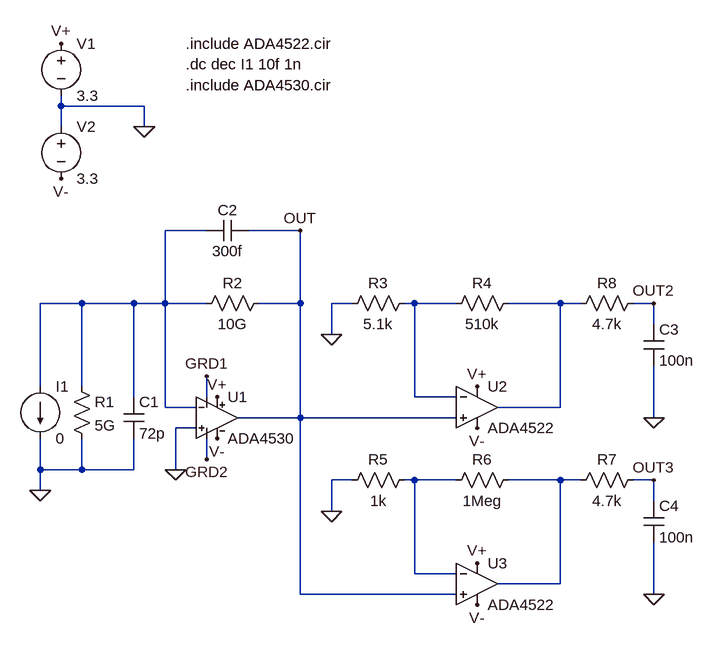
[diagram p0: schematic 008transimpedance_ada4530_ext_amps_trans.asc]
008transimpedance_ada4530_ext_amps_trans.asc, the LTspice schematic file:
Version 4
SHEET 1 1028 680
WIRE 48 -288 48 -304
WIRE 176 -288 48 -288
WIRE 48 -256 48 -288
WIRE 176 -256 176 -288
WIRE 272 -96 208 -96
WIRE 416 -96 336 -96
WIRE 80 16 16 16
WIRE 160 16 80 16
WIRE 208 16 208 -96
WIRE 208 16 160 16
WIRE 272 16 208 16
WIRE 416 16 416 -96
WIRE 416 16 352 16
WIRE 496 16 464 16
WIRE 592 16 576 16
WIRE 656 16 592 16
WIRE 816 16 736 16
WIRE 848 16 816 16
WIRE 960 16 928 16
WIRE 960 48 960 16
WIRE 464 64 464 16
WIRE 16 144 16 16
WIRE 80 144 80 16
WIRE 160 160 160 16
WIRE 272 160 272 128
WIRE 592 160 592 16
WIRE 656 160 592 160
WIRE 208 176 208 16
WIRE 256 176 208 176
WIRE 816 176 816 16
WIRE 816 176 720 176
WIRE 416 192 416 16
WIRE 416 192 320 192
WIRE 656 192 416 192
WIRE 960 192 960 112
WIRE 256 208 224 208
WIRE 272 256 272 224
WIRE 16 272 16 224
WIRE 80 272 80 224
WIRE 80 272 16 272
WIRE 160 272 160 224
WIRE 160 272 80 272
WIRE 224 272 224 208
WIRE 496 288 464 288
WIRE 592 288 576 288
WIRE 656 288 592 288
WIRE 816 288 736 288
WIRE 848 288 816 288
WIRE 960 288 928 288
WIRE 16 304 16 272
WIRE 960 320 960 288
WIRE 464 336 464 288
WIRE 592 432 592 288
WIRE 656 432 592 432
WIRE 816 448 816 288
WIRE 816 448 720 448
WIRE 416 464 416 192
WIRE 656 464 416 464
WIRE 960 464 960 384
FLAG 16 304 0
FLAG 224 272 0
FLAG 176 -256 0
FLAG 48 -384 V+
FLAG 48 -176 V-
FLAG 288 160 V+
FLAG 416 -96 OUT
FLAG 272 128 GRD1
FLAG 272 256 GRD2
FLAG 288 224 V-
FLAG 688 208 V-
FLAG 688 144 V+
FLAG 464 64 0
FLAG 688 480 V-
FLAG 688 416 V+
FLAG 464 336 0
FLAG 960 464 0
FLAG 960 192 0
FLAG 960 16 OUT2
FLAG 960 288 OUT3
SYMBOL current 16 144 R0
WINDOW 123 0 0 Left 2
WINDOW 39 0 0 Left 2
SYMATTR InstName I1
SYMATTR Value 0
SYMBOL res 64 128 R0
SYMATTR InstName R1
SYMATTR Value 5G
SYMBOL cap 144 160 R0
SYMATTR InstName C1
SYMATTR Value 72p
SYMBOL res 368 0 R90
WINDOW 0 0 56 VBottom 2
WINDOW 3 32 56 VTop 2
SYMATTR InstName R2
SYMATTR Value 10G
SYMBOL voltage 48 -400 R0
WINDOW 123 0 0 Left 2
WINDOW 39 0 0 Left 2
SYMATTR InstName V1
SYMATTR Value 3.3
SYMBOL voltage 48 -272 R0
WINDOW 123 0 0 Left 2
WINDOW 39 0 0 Left 2
SYMATTR InstName V2
SYMATTR Value 3.3
SYMBOL opamp_with_guards 288 128 R0
SYMATTR InstName U1
SYMATTR Value ADA4530
SYMBOL Opamps\\opamp2 688 112 R0
SYMATTR InstName U2
SYMATTR Value ADA4522
SYMBOL res 592 0 R90
WINDOW 0 0 56 VBottom 2
WINDOW 3 32 56 VTop 2
SYMATTR InstName R3
SYMATTR Value 5.1k
SYMBOL res 752 0 R90
WINDOW 0 0 56 VBottom 2
WINDOW 3 32 56 VTop 2
SYMATTR InstName R4
SYMATTR Value 510k
SYMBOL cap 336 -112 R90
WINDOW 0 0 32 VBottom 2
WINDOW 3 32 32 VTop 2
SYMATTR InstName C2
SYMATTR Value 300f
SYMBOL Opamps\\opamp2 688 384 R0
SYMATTR InstName U3
SYMATTR Value ADA4522
SYMBOL res 592 272 R90
WINDOW 0 0 56 VBottom 2
WINDOW 3 32 56 VTop 2
SYMATTR InstName R5
SYMATTR Value 1k
SYMBOL res 752 272 R90
WINDOW 0 0 56 VBottom 2
WINDOW 3 32 56 VTop 2
SYMATTR InstName R6
SYMATTR Value 1Meg
SYMBOL res 944 272 R90
WINDOW 0 0 56 VBottom 2
WINDOW 3 32 56 VTop 2
SYMATTR InstName R7
SYMATTR Value 4.7k
SYMBOL res 944 0 R90
WINDOW 0 0 56 VBottom 2
WINDOW 3 32 56 VTop 2
SYMATTR InstName R8
SYMATTR Value 4.7k
SYMBOL cap 944 48 R0
SYMATTR InstName C3
SYMATTR Value 100n
SYMBOL cap 944 320 R0
SYMATTR InstName C4
SYMATTR Value 100n
TEXT 240 -352 Left 2 !.dc dec I1 10f 1n
TEXT 240 -320 Left 2 !.include ADA4530.cir
TEXT 240 -384 Left 2 !.include ADA4522.cir

The netlist it stands for:
* 008transimpedance_ada4530_ext_amps_trans.asc
I1 N001 0 0
R1 N001 0 5G
C1 N001 0 72p
R2 OUT N001 10G
V1 V+ 0 3.3
V2 0 V- 3.3
XU1 0 N001 V+ V- OUT GRD1 GRD2 ADA4530  ; pins In+ In- V+ V- OUT GRD1 GRD2
XU2 OUT N002 V+ V- N003 ADA4522  ; pins In+ In- V+ V- OUT
R3 N002 0 5.1k
R4 N003 N002 510k
C2 OUT N001 300f
XU3 OUT N004 V+ V- N005 ADA4522  ; pins In+ In- V+ V- OUT
R5 N004 0 1k
R6 N005 N004 1Meg
R7 OUT3 N005 4.7k
R8 OUT2 N003 4.7k
C3 OUT2 0 100n
C4 OUT3 0 100n
.dc dec I1 10f 1n
.include ADA4530.cir
.include ADA4522.cir
.backanno
.end

* Results of the author's LTspice run, read from the files saved beside the schematic
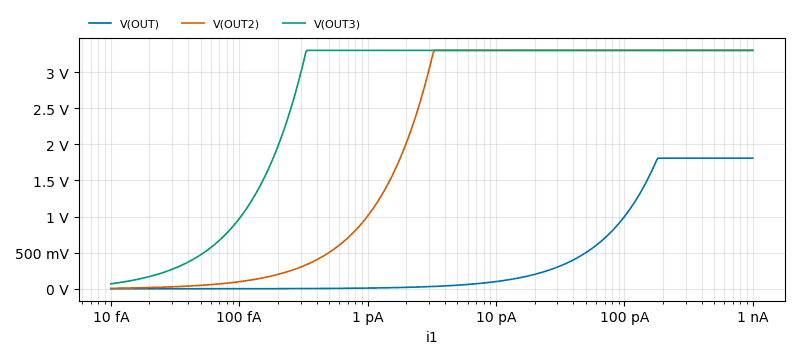
[diagram p1: DC transfer characteristic of 008transimpedance_ada4530_ext_amps_trans.asc, plotted from the saved traces]
* DC transfer characteristic, 1 run:
*   V(OUT): 75.99 µV at i1=10 fA, 1.808 V at i1=1 nA, min 75.99 µV, max 1.808 V
*   V(OUT2): 6.965 mV at i1=10 fA, 3.3 V at i1=1 nA, min 6.965 mV, max 3.3 V
*   V(OUT3): 69.43 mV at i1=10 fA, 3.3 V at i1=1 nA, min 69.43 mV, max 3.3 V